# Altium schematic sheet OVERVIEW.SchDoc
size A4; SheetNumber: 1; SheetTotal: 5
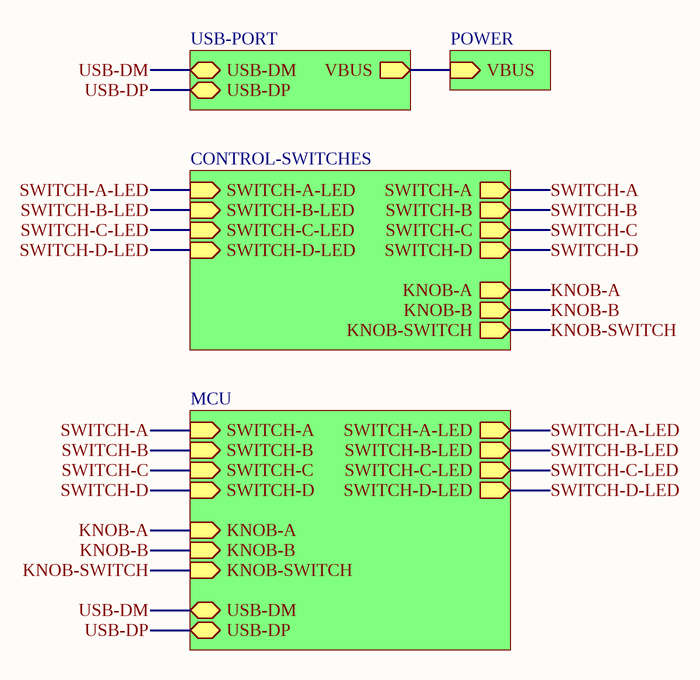
[diagram p0: OVERVIEW.SchDoc]

## Sub-sheets
CONTROL-SWITCHES = CONTROL-SWITCHES.SchDoc: SWITCH-A-LED (in), SWITCH-B-LED (in), SWITCH-C-LED (in), SWITCH-D-LED (in), SWITCH-A (out), SWITCH-B (out), SWITCH-C (out), SWITCH-D (out), KNOB-A (out), KNOB-B (out), KNOB-SWITCH (out)
MCU = MCU.SchDoc: SWITCH-A-LED (out), SWITCH-B-LED (out), SWITCH-C-LED (out), SWITCH-D-LED (out), SWITCH-A (in), SWITCH-B (in), SWITCH-C (in), SWITCH-D (in), KNOB-A (in), KNOB-B (in), KNOB-SWITCH (in), USB-DM (bidir), USB-DP (bidir)
POWER = POWER.SchDoc: VBUS (in)
USB-PORT = USB-PORT.SchDoc: USB-DM (bidir), USB-DP (bidir), VBUS (out)

## Nets
KNOB-A: sheet CONTROL-SWITCHES/KNOB-A, sheet MCU/KNOB-A
KNOB-B: sheet CONTROL-SWITCHES/KNOB-B, sheet MCU/KNOB-B
KNOB-SWITCH: sheet CONTROL-SWITCHES/KNOB-SWITCH, sheet MCU/KNOB-SWITCH
SWITCH-A: sheet CONTROL-SWITCHES/SWITCH-A, sheet MCU/SWITCH-A
SWITCH-A-LED: sheet CONTROL-SWITCHES/SWITCH-A-LED, sheet MCU/SWITCH-A-LED
SWITCH-B: sheet CONTROL-SWITCHES/SWITCH-B, sheet MCU/SWITCH-B
SWITCH-B-LED: sheet CONTROL-SWITCHES/SWITCH-B-LED, sheet MCU/SWITCH-B-LED
SWITCH-C: sheet CONTROL-SWITCHES/SWITCH-C, sheet MCU/SWITCH-C
SWITCH-C-LED: sheet CONTROL-SWITCHES/SWITCH-C-LED, sheet MCU/SWITCH-C-LED
SWITCH-D: sheet CONTROL-SWITCHES/SWITCH-D, sheet MCU/SWITCH-D
SWITCH-D-LED: sheet CONTROL-SWITCHES/SWITCH-D-LED, sheet MCU/SWITCH-D-LED
USB-DM: sheet USB-PORT/USB-DM, sheet MCU/USB-DM
USB-DP: sheet USB-PORT/USB-DP, sheet MCU/USB-DP
(unnamed): sheet POWER/VBUS, sheet USB-PORT/VBUS